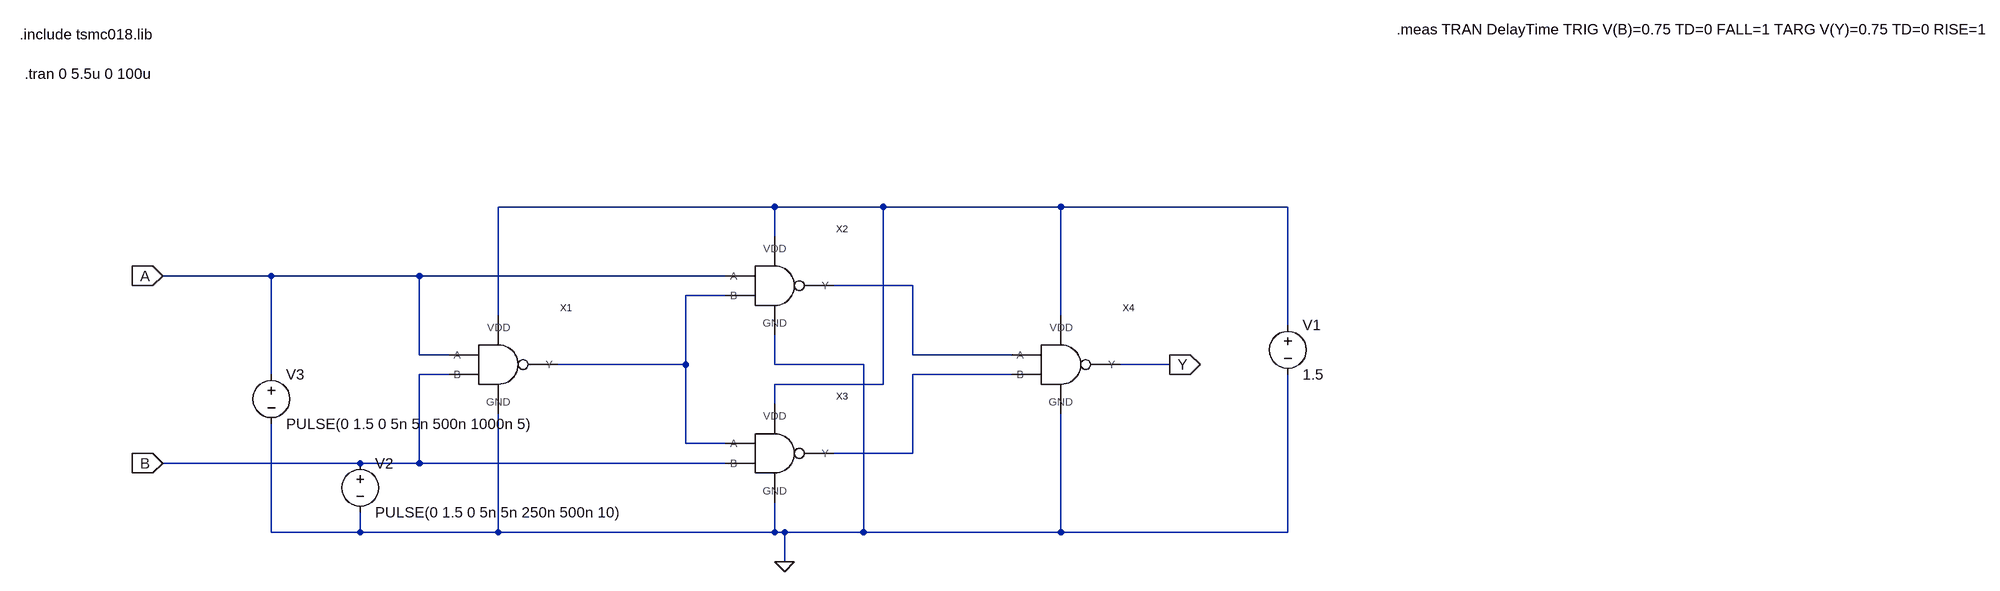
[diagram p0: schematic xor_with_nand.asc]
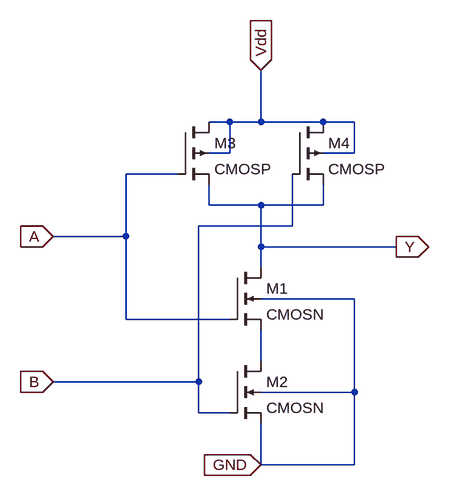
[diagram p1: sub-circuit cmos_nand.asc]
xor_with_nand.asc, the LTspice schematic file:
Version 4
SHEET 1 2580 772
WIRE 576 176 128 176
WIRE 752 176 576 176
WIRE 1040 176 752 176
WIRE 1408 176 1040 176
WIRE 576 224 576 176
WIRE -240 288 -416 288
WIRE 0 288 -240 288
WIRE 496 288 0 288
WIRE 800 304 672 304
WIRE 496 320 432 320
WIRE 128 352 128 176
WIRE 1040 352 1040 176
WIRE 1408 368 1408 176
WIRE 0 416 0 288
WIRE 48 416 0 416
WIRE 800 416 800 304
WIRE 960 416 800 416
WIRE 432 432 432 320
WIRE 432 432 224 432
WIRE 576 432 576 384
WIRE 720 432 576 432
WIRE 1216 432 1136 432
WIRE -240 448 -240 288
WIRE 48 448 0 448
WIRE 960 448 800 448
WIRE 752 464 752 176
WIRE 752 464 576 464
WIRE 576 496 576 464
WIRE 432 560 432 432
WIRE 496 560 432 560
WIRE 800 576 800 448
WIRE 800 576 672 576
WIRE -96 592 -416 592
WIRE 0 592 0 448
WIRE 0 592 -96 592
WIRE 496 592 0 592
WIRE -240 704 -240 528
WIRE -96 704 -96 672
WIRE -96 704 -240 704
WIRE 128 704 128 512
WIRE 128 704 -96 704
WIRE 576 704 576 656
WIRE 576 704 128 704
WIRE 592 704 576 704
WIRE 720 704 720 432
WIRE 720 704 592 704
WIRE 1040 704 1040 512
WIRE 1040 704 720 704
WIRE 1408 704 1408 448
WIRE 1408 704 1040 704
WIRE 592 752 592 704
FLAG -416 288 A
IOPIN -416 288 In
FLAG -416 592 B
IOPIN -416 592 In
FLAG 1216 432 Y
IOPIN 1216 432 Out
FLAG 592 752 0
SYMBOL cmos_NAND 128 400 R0
SYMATTR InstName X1
SYMBOL cmos_NAND 576 272 R0
SYMATTR InstName X2
SYMBOL cmos_NAND 576 544 R0
SYMATTR InstName X3
SYMBOL cmos_NAND 1040 400 R0
SYMATTR InstName X4
SYMBOL voltage 1408 352 R0
WINDOW 123 0 0 Left 0
WINDOW 39 0 0 Left 0
SYMATTR InstName V1
SYMATTR Value 1.5
SYMBOL voltage -96 576 R0
WINDOW 123 0 0 Left 0
WINDOW 39 0 0 Left 0
SYMATTR InstName V2
SYMATTR Value PULSE(0 1.5 0 5n 5n 250n 500n 10)
SYMBOL voltage -240 432 R0
WINDOW 123 0 0 Left 0
WINDOW 39 0 0 Left 0
SYMATTR InstName V3
SYMATTR Value PULSE(0 1.5 0 5n 5n 500n 1000n 5)
TEXT -648 -104 Left 2 !.include tsmc018.lib
TEXT -640 -40 Left 2 !.tran 0 5.5u 0 100u
TEXT 1584 -112 Left 2 !.meas TRAN DelayTime TRIG V(B)=0.75 TD=0 FALL=1 TARG V(Y)=0.75 TD=0 RISE=1

cmos_nand.asc, the sub-circuit schematic file:
Version 4
SHEET 1 880 680
WIRE 224 -144 192 -144
WIRE 272 -144 272 -224
WIRE 272 -144 224 -144
WIRE 368 -144 272 -144
WIRE 416 -144 368 -144
WIRE 224 -96 224 -144
WIRE 224 -96 192 -96
WIRE 416 -96 416 -144
WIRE 416 -96 368 -96
WIRE 144 -64 64 -64
WIRE 192 -16 192 -48
WIRE 272 -16 192 -16
WIRE 368 -16 368 -48
WIRE 368 -16 272 -16
WIRE 320 16 320 -64
WIRE 320 16 176 16
WIRE 64 32 64 -64
WIRE 64 32 -48 32
WIRE 272 48 272 -16
WIRE 480 48 272 48
WIRE 272 80 272 48
WIRE 416 128 272 128
WIRE 64 160 64 32
WIRE 224 160 64 160
WIRE 272 224 272 176
WIRE 176 256 176 16
WIRE 176 256 -48 256
WIRE 416 272 416 128
WIRE 416 272 272 272
WIRE 176 304 176 256
WIRE 224 304 176 304
WIRE 272 384 272 320
WIRE 416 384 416 272
WIRE 416 384 272 384
FLAG 480 48 Y
IOPIN 480 48 Out
FLAG -48 32 A
IOPIN -48 32 In
FLAG -48 256 B
IOPIN -48 256 In
FLAG 272 -224 Vdd
IOPIN 272 -224 In
FLAG 272 384 GND
IOPIN 272 384 In
SYMBOL cmosn 224 80 R0
SYMATTR InstName M1
SYMBOL cmosn 224 224 R0
SYMATTR InstName M2
SYMBOL cmosp 144 -144 R0
SYMATTR InstName M3
SYMBOL cmosp 320 -144 R0
SYMATTR InstName M4

The netlist it stands for:
* xor_with_nand.asc
XX1 N001 0 A B N003 cmos_nand
XX2 N001 0 A N003 N002 cmos_nand
XX3 N001 0 N003 B N004 cmos_nand
XX4 N001 0 N002 N004 Y cmos_nand
V1 N001 0 1.5
V2 B 0 PULSE(0 1.5 0 5n 5n 250n 500n 10)
V3 A 0 PULSE(0 1.5 0 5n 5n 500n 1000n 5)

* block symbol definitions
.subckt cmos_nand VDD GND A B Y
M1 Y A N001 GND CMOSN
M2 N001 B GND GND CMOSN
M3 Vdd A Y Vdd CMOSP
M4 Vdd B Y Vdd CMOSP
.ends cmos_nand

.model NMOS NMOS
.model PMOS PMOS
.lib standard.mos
.include tsmc018.lib
.tran 0 5.5u 0 100u
.meas TRAN DelayTime TRIG V(B)=0.75 TD=0 FALL=1 TARG V(Y)=0.75 TD=0 RISE=1
.backanno
.end